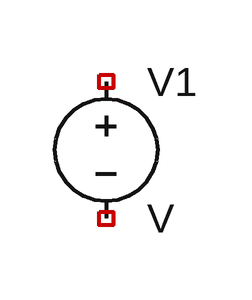
[diagram p0: schematic Draft8.asc]
Draft8.asc, the LTspice schematic file:
Version 4.1
SHEET 1 880 680
SYMBOL voltage -80 112 R0
SYMATTR InstName V1

The netlist it stands for:
* Draft8.asc
V1 NC_01 NC_02 V
.backanno
.end